# Altium schematic sheet electrodePCB.schdoc
size 143 x 76 mm
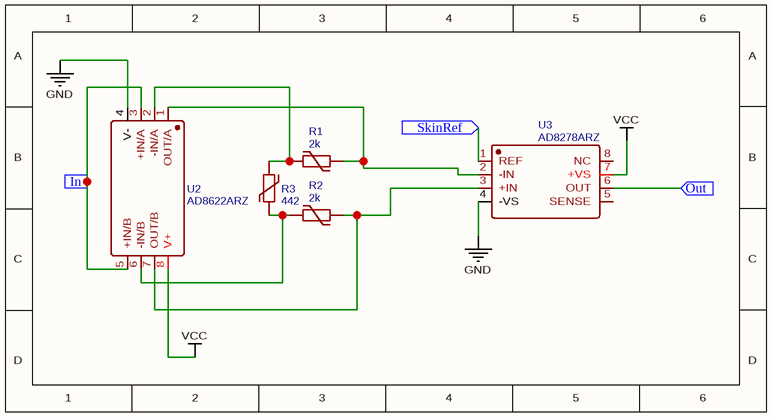
[diagram p0: electrodePCB.schdoc]

## Parts
R1  2k  [D0402]
R2  2k  [D0402]
R3  442  [R0603]
U2  AD8622ARZ  [SOIC-8_L4.9-W3.9-P1.27-LS6.0-BL]
U3  AD8278ARZ  [SOIC-8_L4.9-W3.9-P1.27-LS6.0-BL]

## Ports
In (in), Out (in), SkinRef (in)

## Nets
GND: U2.4(V-) U3.4(-VS)
VCC: U2.8(V+) U3.7(+VS)
In: U2.3(+IN/A) U2.5(+IN/B) ; port In
Out: U3.6(OUT) ; port Out
SkinRef: U3.1(REF) ; port SkinRef
NetR1_1: R1.1 R3.2 U2.2(-IN/A)
NetR1_2: R1.2 U2.1(OUT/A) U3.2(-IN)
NetR2_1: R2.1 R3.1 U2.6(-IN/B)
NetR2_2: R2.2 U2.7(OUT/B) U3.3(+IN)

Not connected (* = marked no-connect by the designer): U3 5(SENSE) 8(NC)

## Library data of the parts
R1 R2 = 2k: BOM_Manufacturer: ResistorToday; BOM_Manufacturer Part: TCTR0402F100KF3950T; nameAlias: Value; Contributor: LCSC; BOM_Supplier: LCSC; BOM_Supplier Part: C388274; spicePre: R; spiceSymbolName: TCTR0402F100KF3950T
R3 = 442: BOM_Manufacturer: ResistorToday; BOM_Manufacturer Part: TCTR0603F10K0F3980T; nameAlias: Value; Contributor: LCSC; BOM_Supplier: LCSC; BOM_Supplier Part: C388281; spicePre: R; spiceSymbolName: TCTR0603F10K0F3980T
U2 = AD8622ARZ: BOM_Manufacturer: ADI; SMT Type: Extend; BOM_Supplier: LCSC; BOM_Manufacturer Part: AD8622ARZ; BOM_Supplier Part: C106970; BOM_LCSC Assembly: Yes; spicePre: U; spiceSymbolName: AD8622ARZ
U3 = AD8278ARZ: BOM_Manufacturer: Analog Devices; Contributor: LCSC; BOM_Supplier: LCSC; BOM_Supplier Part: C209371; BOM_Manufacturer Part: AD8278ARZ; spicePre: U; spiceSymbolName: AD8278ARZ